# Altium schematic sheet Controller.SchDoc
size A4; SheetNumber: 2; SheetTotal: 8
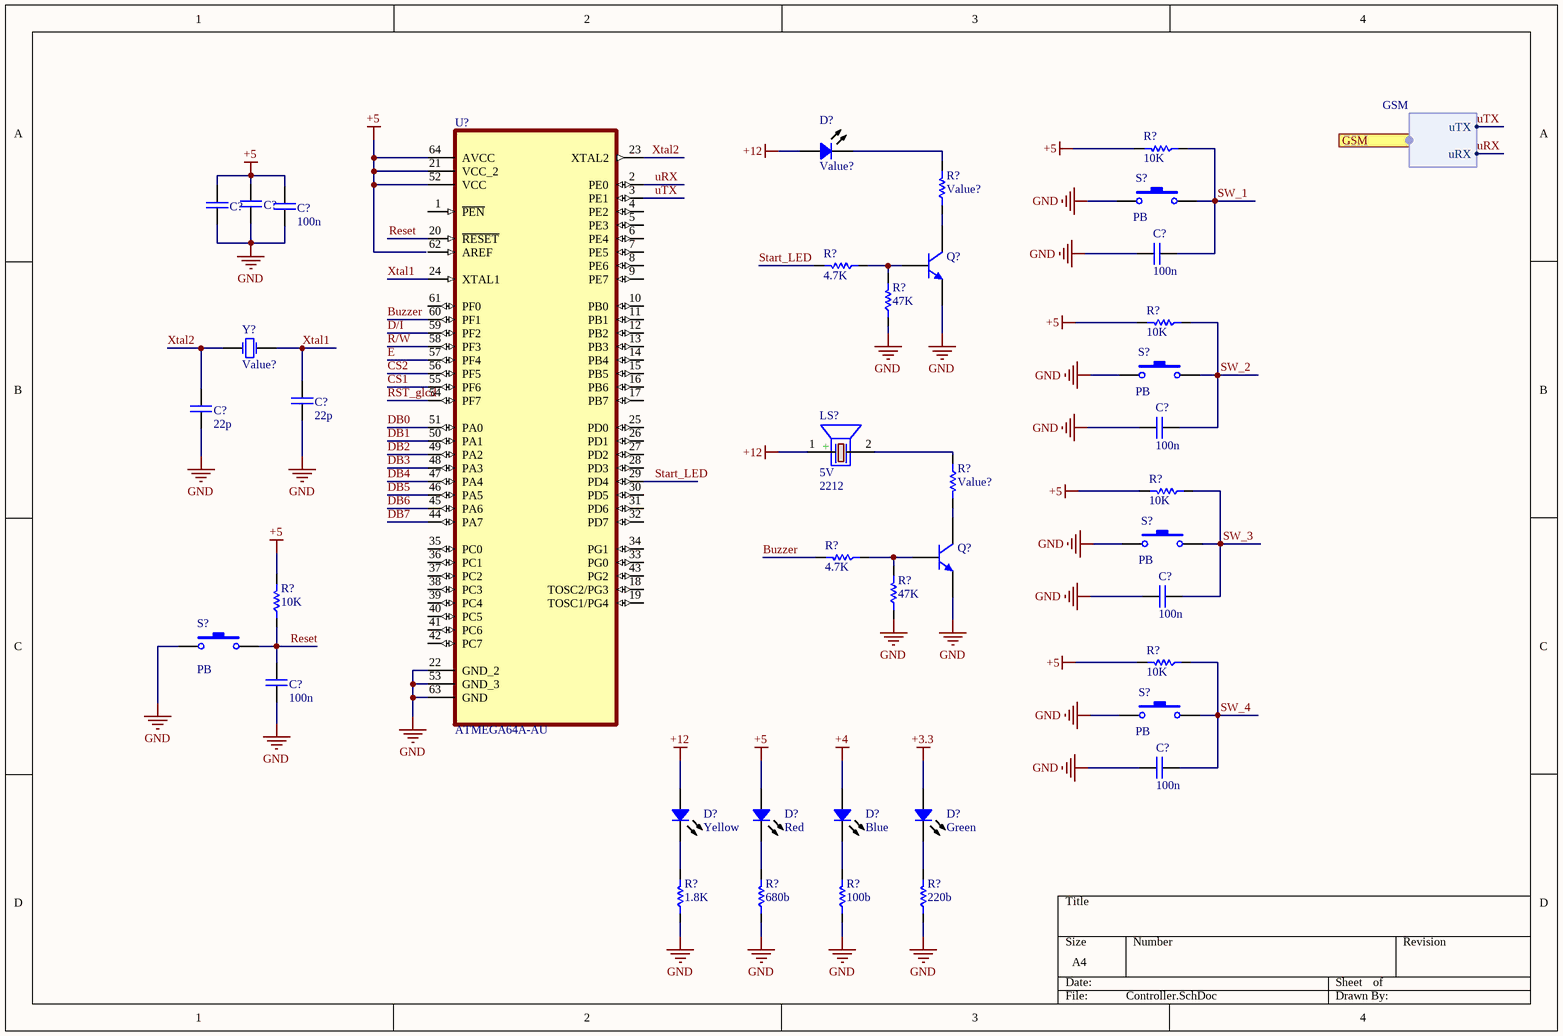
[diagram p0: Controller.SchDoc]

## Parts
(Parts that share a designator on the sheet are numbered #1, #2 ... from top to bottom, then left to right.)
C?#1  (no value)  [CAP 1206/3216]
C?#2  (no value)  [CAP 1206/3216]
C?#3  100n  [CAP 1206/3216]
C?#4  100n  [CAP 1206/3216]
C?#5  22p  [CAP 1206/3216]
C?#6  22p  [CAP 1206/3216]
C?#7  100n  [CAP 1206/3216]
C?#8  100n  [CAP 1206/3216]
C?#9  100n  [CAP 1206/3216]
C?#10  100n  [CAP 1206/3216]
D?#1  Value?  [LED 1206/3216 GREEN]
D?#2  Yellow  [LED 0805/2012 YELLOW]
D?#3  Red  [LED 0805/2012 RED]
D?#4  Blue  [LED 0805/2012 BLUE]
D?#5  Green  [LED 0805/2012 GREEN]
LS?  Inflow: 2212  [BZ_SJ]  (hidden comment: 5V)
Q?#1  NPN  [SOT23_N]  (value not drawn)
Q?#2  NPN  [SOT23_N]  (value not drawn)
R?#1  10K  [RES 1206 (3216X08L)]
R?#2  Value?  [RES 1206 (3216X08L)]
R?#3  4.7K  [RES 1206 (3216X08L)]
R?#4  10K  [RES 1206 (3216X08L)]
R?#5  47K  [RES 1206 (3216X08L)]
R?#6  Value?  [RES 1206 (3216X08L)]
R?#7  10K  [RES 1206 (3216X08L)]
R?#8  4.7K  [RES 1206 (3216X08L)]
R?#9  47K  [RES 1206 (3216X08L)]
R?#10  10K  [RES 1206 (3216X08L)]
R?#11  10K  [RES 1206 (3216X08L)]
R?#12  1.8K  [RES 0805 (2012X06L)]
R?#13  680b  [RES 0805 (2012X06L)]
R?#14  100b  [RES 0805 (2012X06L)]
R?#15  220b  [RES 0805 (2012X06L)]
S?#1  PB  [SW_PB_SMD_2PIN_SPST_6X3X2]
S?#2  PB  [SW_PB_SMD_2PIN_SPST_6X3X2]
S?#3  PB  [SW_PB_SMD_2PIN_SPST_6X3X2]
S?#4  PB  [SW_PB_SMD_2PIN_SPST_6X3X2]
S?#5  PB  [SW_PB_SMD_2PIN_SPST_6X3X2]
U?  ATMEGA64A-AU  [QFP80P1600X1600X120-64N]
Y?  Value?  [XTAL Small]

## Ports
GSM (harness GSM)

## Harnesses
GSM: uTX, uRX

## Nets
+3.3: D?#5.1
+4: D?#4.1
+5: C?#1.1 C?#2.1 C?#3.1 D?#3.1 R?#1.2 R?#4.2 R?#7.2 R?#10.2 R?#11.2 U?.21(VCC_2) U?.52(VCC) U?.64(AVCC)
+12: D?#1.1 D?#2.1 LS?.1(+)
GND: C?#1.2 C?#2.2 C?#3.2 C?#4.2 C?#5.2 C?#6.2 C?#7.2 C?#8.2 C?#9.2 C?#10.2 Q?#1.2(E) Q?#2.2(E) R?#5.1 R?#9.1 R?#12.1 R?#13.1 R?#14.1 R?#15.1 S?#1.1 S?#2.1 S?#3.1 S?#4.1 S?#5.1 U?.22(GND_2) U?.53(GND_3) U?.63(GND)
Buzzer: R?#8.2 U?.60(PF1)
CS1: U?.55(PF6)
CS2: U?.56(PF5)
D/I: U?.59(PF2)
DB0: U?.51(PA0)
DB1: U?.50(PA1)
DB2: U?.49(PA2)
DB3: U?.48(PA3)
DB4: U?.47(PA4)
DB5: U?.46(PA5)
DB6: U?.45(PA6)
DB7: U?.44(PA7)
E: U?.57(PF4)
R/W: U?.58(PF3)
Reset: C?#9.1 R?#10.1 S?#4.2 U?.20(~{RESET})
RST_glcd: U?.54(PF7)
Start_LED: R?#3.2 U?.29(PD4)
SW_1: C?#4.1 R?#1.1 S?#1.2
SW_2: C?#7.1 R?#4.1 S?#2.2
SW_3: C?#8.1 R?#7.1 S?#3.2
SW_4: C?#10.1 R?#11.1 S?#5.2
uRX: U?.2(PE0) ; port GSM.uRX
uTX: U?.3(PE1) ; port GSM.uTX
Xtal1: C?#5.1 U?.24(XTAL1) Y?.2(OSC2)
Xtal2: C?#6.1 U?.23(XTAL2) Y?.1(OSC1)
NetD?#1_2: D?#1.2 R?#2.2
NetD?#2_2: D?#2.2 R?#12.2
NetD?#3_2: D?#3.2 R?#13.2
NetD?#4_2: D?#4.2 R?#14.2
NetD?#5_2: D?#5.2 R?#15.2
NetLS?_2: LS?.2(-) R?#6.1
NetQ?#1_1: Q?#1.1(B) R?#3.1 R?#5.2
NetQ?#1_3: Q?#1.3(C) R?#2.1
NetQ?#2_1: Q?#2.1(B) R?#8.1 R?#9.2
NetQ?#2_3: Q?#2.3(C) R?#6.2

Not connected (* = marked no-connect by the designer): U? 1(~{PEN}) 4(PE2) 5(PE3) 6(PE4) 7(PE5) 8(PE6) 9(PE7) 10(PB0) 11(PB1) 12(PB2) 13(PB3) 14(PB4) 15(PB5) 16(PB6) 17(PB7) 18(TOSC2/PG3) 19(TOSC1/PG4) 25(PD0) 26(PD1) 27(PD2) 28(PD3) 30(PD5) 31(PD6) 32(PD7) 33(PG0) 34(PG1) 35(PC0) 36(PC1) 37(PC2) 38(PC3) 39(PC4) 40(PC5) 41(PC6) 42(PC7) 43(PG2) 61(PF0) 62(AREF)

## Library data of the parts
C?#1-C?#10 = Cap_Multi_SMD_100nF_1206: Bipolar ceramic capacitor SMD; Type: MultiLayer; Inflow: inflow?; Rating: 50V; Validation: Valid; Package: 1206
  C?#3 C?#4 C?#7-C?#10: Value: 100n
  C?#5 C?#6: Value: 22p
D?#1-D?#5 = Semi_LED_SMD: LED; Inflow: inflow?; Rating: Rating?; Validation: Valid; Package: Package?; Type: LED
  D?#1: Value: Value?
  D?#2: Value: Yellow
  D?#3: Value: Red
  D?#4: Value: Blue
  D?#5: Value: Green
LS? = Other_Elec_Buzzer: Magnetic Transducer Buzzer; Rating: 12mm; Validation: Valid; Type: Buzzer; Package: Dip; Value: 5V
Q?#1 Q?#2 = Semi_BJT_BC817: NPN General purpose Transistor; Rating: Rating?; Type: Type?; Validation: Valid; Inflow: inflow?; Value: NPN; Package: Package?
R?#1-R?#11 = Res_SMD_1206: Resistor; Inflow: inflow?; Rating: 0.25W; Validation: Valid; Package: 1206; Type: 10%
  R?#1 R?#4 R?#7 R?#10 R?#11: Value: 10K
  R?#2 R?#6: Value: Value?
  R?#3 R?#8: Value: 4.7K
  R?#5 R?#9: Value: 47K
R?#12-R?#15 = Res_SMD_0805: Resistor; Inflow: inflow?; Rating: 0.125W; Validation: Valid; Package: 0805; Type: 10%
  R?#12: Value: 1.8K
  R?#13: Value: 680b
  R?#14: Value: 100b
  R?#15: Value: 220b
S?#1-S?#5 = SW_PushButton_2_SMD: SMT Tactile ‎Switch; Rating: 2b; Validation: Valid; Inflow: 8260; Type: Vertical; Package: SMD; Value: PB
U? = ATMEGA64A-AU: AVR AVRÂ® ATmega Microcontroller IC 8-Bit 16MHz 64KB (32K x 16) FLASH 64-TQFP (14x14); MF: Microchip; SnapEDA_Link: https://www.snapeda.com/parts/ATMEGA64A-AU/Microchip/view-part/?ref=snap; Package: TQFP-64 Microchip; Value: *; MP: ATMEGA64A-AU; Check_prices: https://www.snapeda.com/parts/ATMEGA64A-AU/Microchip/view-part/?ref=eda
Y? = Other_Elec_Xtal_THT: Crystal Oscillator; Rating: Rating?; Inflow: inflow?; Validation: Valid; Type: Quartz; Package: Dip; Value: Value?